# Altium project MultiChannelLdc_Project.PrjPcb
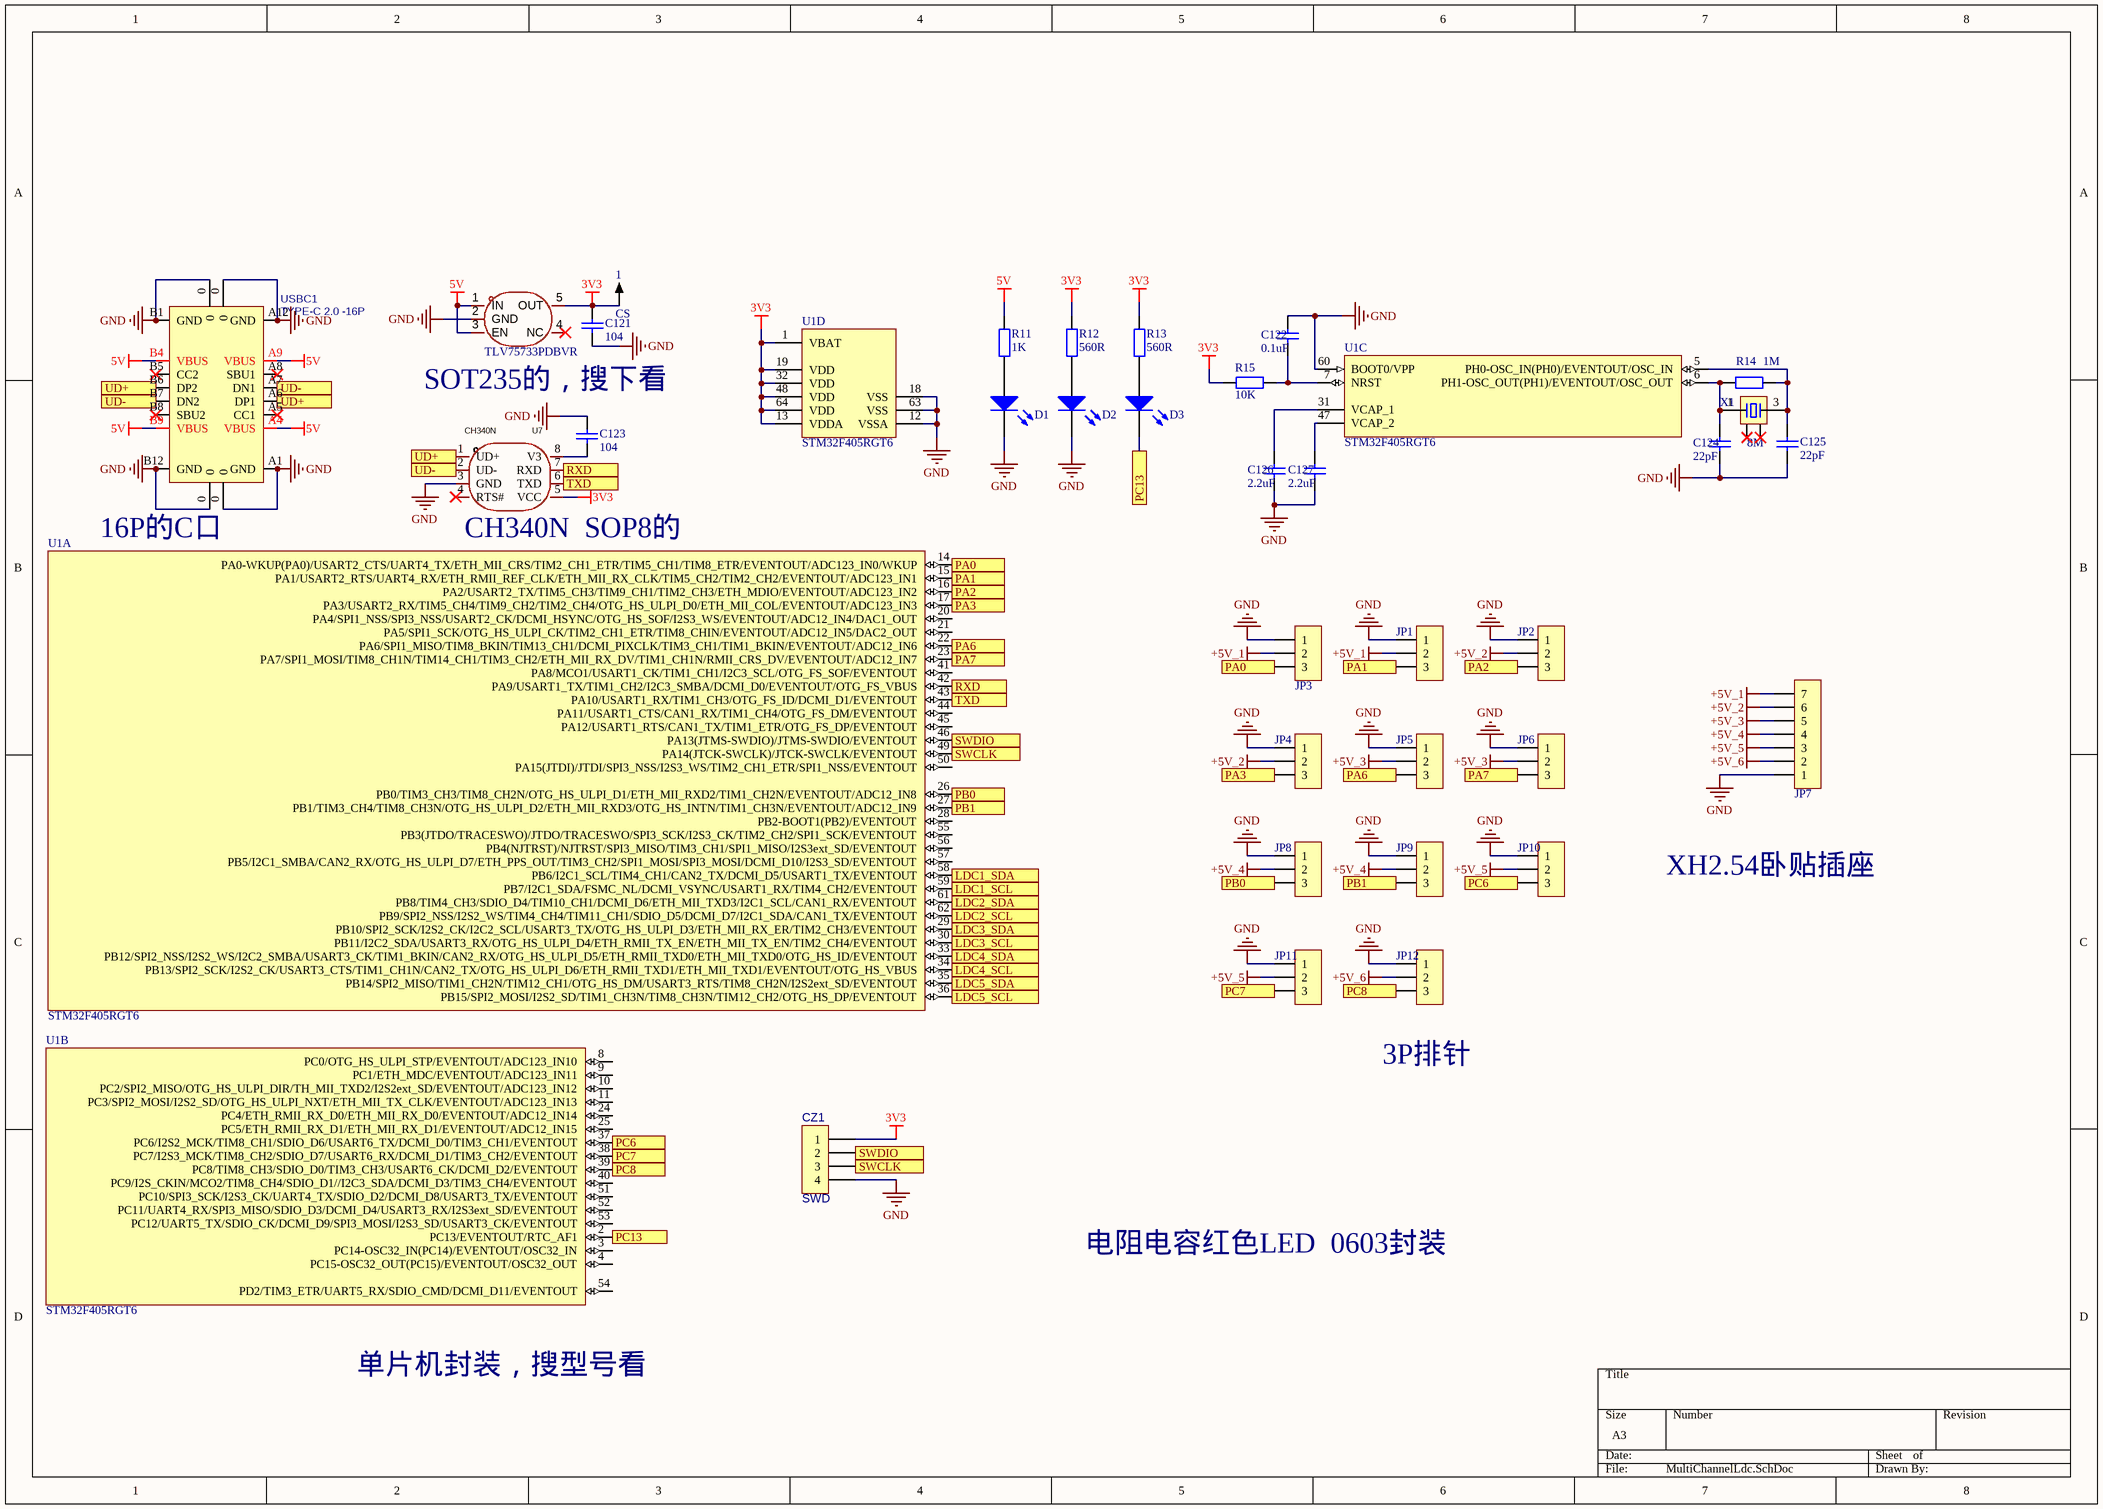
[diagram p0: MultiChannelLdc.SchDoc]
4 sheets, 194 parts. Net scope: flat (ports and power ports of the same name join across sheets).
Board file: MultiChannelLdc.PcbDoc
Sheets:
  MultiChannelLdc.SchDoc
  MultiChannelLdc2.SchDoc
  MultiChannelLdc3.SchDoc
  MultiChannelLdc4.SchDoc

## Sheet MultiChannelLdc.SchDoc
size A3

### Parts
1  CS  [TEST 1.2]
C121  104  [C0603_L]
C122  0.1uF  [C0603_L]
C123  104  [C0603_L]
C124  22pF  [C0603_L]
C125  22pF  [C0603_L]
C126  2.2uF  [C0603_L]
C127  2.2uF  [C0603_L]
CZ1  SWD  [SIP4]
D1  LED  [LED0603_R]  (value not drawn)
D2  LED  [LED0603_R]  (value not drawn)
D3  LED  [LED0603_R]  (value not drawn)
JP1  HDR-1X3  [HDR2.54-LI-3P]  (value not drawn)
JP2  HDR-1X3  [HDR2.54-LI-3P]  (value not drawn)
JP3  HDR-1X3  [HDR2.54-LI-3P]  (value not drawn)
JP4  HDR-1X3  [HDR2.54-LI-3P]  (value not drawn)
JP5  HDR-1X3  [HDR2.54-LI-3P]  (value not drawn)
JP6  HDR-1X3  [HDR2.54-LI-3P]  (value not drawn)
JP7  HDR-1X7  [XH2.54-LS-7P]  (value not drawn)
JP8  HDR-1X3  [HDR2.54-LI-3P]  (value not drawn)
JP9  HDR-1X3  [HDR2.54-LI-3P]  (value not drawn)
JP10  HDR-1X3  [HDR2.54-LI-3P]  (value not drawn)
JP11  HDR-1X3  [HDR2.54-LI-3P]  (value not drawn)
JP12  HDR-1X3  [HDR2.54-LI-3P]  (value not drawn)
R11  1K  [R0603_L]
R12  560R  [R0603_L]
R13  560R  [R0603_L]
R14  1M  [R0603_L]
R15  10K  [R0603_L]
U1  STM32F405RGT6  [TQFP64_V]  (parts A,B,C,D of 4)
U6  TLV75733PDBVR  [SOT23-5]
U7  CH340N  [SOP8_N]
USBC1  TYPE-C 2.0 -16P  [USB-C-SMD_16P]
X1  8M  [SMD3225]

### Ports
LDC1_SCL, LDC1_SDA, LDC2_SCL, LDC2_SDA, LDC3_SCL, LDC3_SDA, LDC4_SCL, LDC4_SDA, LDC5_SCL, LDC5_SDA, PA0, PA1, PA2, PA3, PA6, PA7, PB0, PB1, PC6, PC7, PC8, PC13, RXD, SWCLK, SWDIO, TXD, UD+, UD-

### Nets
3V3: 1.1 C121.2 CZ1.1 R12.2 R13.2 R15.1 U1.1(VBAT) U1.13(VDDA) U1.19(VDD) U1.32(VDD) U1.48(VDD) U1.64(VDD) U6.5(OUT) U7.5(VCC)
5V: R11.2 U6.1(IN) U6.3(EN) USBC1.A4(VBUS) USBC1.A9(VBUS) USBC1.B4(VBUS) USBC1.B9(VBUS)
+5V_1: JP1.2 JP3.2 JP7.7
+5V_2: JP2.2 JP4.2 JP7.6
+5V_3: JP5.2 JP6.2 JP7.5
+5V_4: JP7.4 JP8.2 JP9.2
+5V_5: JP7.3 JP10.2 JP11.2
+5V_6: JP7.2 JP12.2
GND: C121.1 C122.2 C123.2 C124.1 C125.1 C126.1 C127.1 CZ1.4 D1.2(K) D2.2(K) JP1.1 JP2.1 JP3.1 JP4.1 JP5.1 JP6.1 JP7.1 JP8.1 JP9.1 JP10.1 JP11.1 JP12.1 U1.12(VSSA) U1.18(VSS) U1.60(BOOT0/VPP) U1.63(VSS) U6.2(GND) U7.3(GND) USBC1.0 USBC1.A1(GND) USBC1.A12(GND) USBC1.B1(GND) USBC1.B12(GND)
NetC122_1: C122.1 R15.2 U1.7(NRST)
NetC123_1: C123.1 U7.8(V3)
NetC124_2: C124.2 R14.2 U1.6(PH1-OSC_OUT(PH1)/EVENTOUT/OSC_OUT) X1.1
NetC125_2: C125.2 R14.1 U1.5(PH0-OSC_IN(PH0)/EVENTOUT/OSC_IN) X1.3
NetC126_2: C126.2 U1.31(VCAP_1)
NetC127_2: C127.2 U1.47(VCAP_2)
NetCZ1_2: CZ1.2 U1.46(PA13(JTMS-SWDIO)/JTMS-SWDIO/EVENTOUT) ; port SWDIO
NetCZ1_3: CZ1.3 U1.49(PA14(JTCK-SWCLK)/JTCK-SWCLK/EVENTOUT) ; port SWCLK
NetD1_1: D1.1(A) R11.1
NetD2_1: D2.1(A) R12.1
NetD3_1: D3.1(A) R13.1
NetD3_2: D3.2(K) U1.2(PC13/EVENTOUT/RTC_AF1) ; port PC13
NetJP1_3: JP1.3 U1.15(PA1/USART2_RTS/UART4_RX/ETH_RMII_REF_CLK/ETH_MII_RX_CLK/TIM5_CH2/TIM2_CH2/EVENTOUT/ADC123_IN1) ; port PA1
NetJP2_3: JP2.3 U1.16(PA2/USART2_TX/TIM5_CH3/TIM9_CH1/TIM2_CH3/ETH_MDIO/EVENTOUT/ADC123_IN2) ; port PA2
NetJP3_3: JP3.3 U1.14(PA0-WKUP(PA0)/USART2_CTS/UART4_TX/ETH_MII_CRS/TIM2_CH1_ETR/TIM5_CH1/TIM8_ETR/EVENTOUT/ADC123_IN0/WKUP) ; port PA0
NetJP4_3: JP4.3 U1.17(PA3/USART2_RX/TIM5_CH4/TIM9_CH2/TIM2_CH4/OTG_HS_ULPI_D0/ETH_MII_COL/EVENTOUT/ADC123_IN3) ; port PA3
NetJP5_3: JP5.3 U1.22(PA6/SPI1_MISO/TIM8_BKIN/TIM13_CH1/DCMI_PIXCLK/TIM3_CH1/TIM1_BKIN/EVENTOUT/ADC12_IN6) ; port PA6
NetJP6_3: JP6.3 U1.23(PA7/SPI1_MOSI/TIM8_CH1N/TIM14_CH1/TIM3_CH2/ETH_MII_RX_DV/TIM1_CH1N/RMII_CRS_DV/EVENTOUT/ADC12_IN7) ; port PA7
NetJP8_3: JP8.3 U1.26(PB0/TIM3_CH3/TIM8_CH2N/OTG_HS_ULPI_D1/ETH_MII_RXD2/TIM1_CH2N/EVENTOUT/ADC12_IN8) ; port PB0
NetJP9_3: JP9.3 U1.27(PB1/TIM3_CH4/TIM8_CH3N/OTG_HS_ULPI_D2/ETH_MII_RXD3/OTG_HS_INTN/TIM1_CH3N/EVENTOUT/ADC12_IN9) ; port PB1
NetJP10_3: JP10.3 U1.37(PC6/I2S2_MCK/TIM8_CH1/SDIO_D6/USART6_TX/DCMI_D0/TIM3_CH1/EVENTOUT) ; port PC6
NetJP11_3: JP11.3 U1.38(PC7/I2S3_MCK/TIM8_CH2/SDIO_D7/USART6_RX/DCMI_D1/TIM3_CH2/EVENTOUT) ; port PC7
NetJP12_3: JP12.3 U1.39(PC8/TIM8_CH3/SDIO_D0/TIM3_CH3/USART6_CK/DCMI_D2/EVENTOUT) ; port PC8
NetR1_1: U1.58(PB6/I2C1_SCL/TIM4_CH1/CAN2_TX/DCMI_D5/USART1_TX/EVENTOUT) ; port LDC1_SDA
NetR3_1: U1.61(PB8/TIM4_CH3/SDIO_D4/TIM10_CH1/DCMI_D6/ETH_MII_TXD3/I2C1_SCL/CAN1_RX/EVENTOUT) ; port LDC2_SDA
NetR5_1: U1.29(PB10/SPI2_SCK/I2S2_CK/I2C2_SCL/USART3_TX/OTG_HS_ULPI_D3/ETH_MII_RX_ER/TIM2_CH3/EVENTOUT) ; port LDC3_SDA
NetR7_1: U1.33(PB12/SPI2_NSS/I2S2_WS/I2C2_SMBA/USART3_CK/TIM1_BKIN/CAN2_RX/OTG_HS_ULPI_D5/ETH_RMII_TXD0/ETH_MII_TXD0/OTG_HS_ID/EVENTOUT) ; port LDC4_SDA
NetR9_1: U1.35(PB14/SPI2_MISO/TIM1_CH2N/TIM12_CH1/OTG_HS_DM/USART3_RTS/TIM8_CH2N/I2S2ext_SD/EVENTOUT) ; port LDC5_SDA
NetU1_30: U1.30(PB11/I2C2_SDA/USART3_RX/OTG_HS_ULPI_D4/ETH_RMII_TX_EN/ETH_MII_TX_EN/TIM2_CH4/EVENTOUT) ; port LDC3_SCL
NetU1_34: U1.34(PB13/SPI2_SCK/I2S2_CK/USART3_CTS/TIM1_CH1N/CAN2_TX/OTG_HS_ULPI_D6/ETH_RMII_TXD1/ETH_MII_TXD1/EVENTOUT/OTG_HS_VBUS) ; port LDC4_SCL
NetU1_36: U1.36(PB15/SPI2_MOSI/I2S2_SD/TIM1_CH3N/TIM8_CH3N/TIM12_CH2/OTG_HS_DP/EVENTOUT) ; port LDC5_SCL
NetU1_42: U1.42(PA9/USART1_TX/TIM1_CH2/I2C3_SMBA/DCMI_D0/EVENTOUT/OTG_FS_VBUS) U7.7(RXD) ; port RXD
NetU1_43: U1.43(PA10/USART1_RX/TIM1_CH3/OTG_FS_ID/DCMI_D1/EVENTOUT) U7.6(TXD) ; port TXD
NetU1_59: U1.59(PB7/I2C1_SDA/FSMC_NL/DCMI_VSYNC/USART1_RX/TIM4_CH2/EVENTOUT) ; port LDC1_SCL
NetU1_62: U1.62(PB9/SPI2_NSS/I2S2_WS/TIM4_CH4/TIM11_CH1/SDIO_D5/DCMI_D7/I2C1_SDA/CAN1_TX/EVENTOUT) ; port LDC2_SCL
NetU7_1: U7.1(UD+) USBC1.A6(DP1) USBC1.B6(DP2) ; port UD+
NetU7_2: U7.2(UD-) USBC1.A7(DN1) USBC1.B7(DN2) ; port UD-

Not connected (* = marked no-connect by the designer): U1 3(PC14-OSC32_IN(PC14)/EVENTOUT/OSC32_IN) 4(PC15-OSC32_OUT(PC15)/EVENTOUT/OSC32_OUT) 8(PC0/OTG_HS_ULPI_STP/EVENTOUT/ADC123_IN10) 9(PC1/ETH_MDC/EVENTOUT/ADC123_IN11) 10(PC2/SPI2_MISO/OTG_HS_ULPI_DIR/TH_MII_TXD2/I2S2ext_SD/EVENTOUT/ADC123_IN12) 11(PC3/SPI2_MOSI/I2S2_SD/OTG_HS_ULPI_NXT/ETH_MII_TX_CLK/EVENTOUT/ADC123_IN13) 20(PA4/SPI1_NSS/SPI3_NSS/USART2_CK/DCMI_HSYNC/OTG_HS_SOF/I2S3_WS/EVENTOUT/ADC12_IN4/DAC1_OUT) 21(PA5/SPI1_SCK/OTG_HS_ULPI_CK/TIM2_CH1_ETR/TIM8_CHIN/EVENTOUT/ADC12_IN5/DAC2_OUT) 24(PC4/ETH_RMII_RX_D0/ETH_MII_RX_D0/EVENTOUT/ADC12_IN14) 25(PC5/ETH_RMII_RX_D1/ETH_MII_RX_D1/EVENTOUT/ADC12_IN15) 28(PB2-BOOT1(PB2)/EVENTOUT) 40(PC9/I2S_CKIN/MCO2/TIM8_CH4/SDIO_D1//I2C3_SDA/DCMI_D3/TIM3_CH4/EVENTOUT) 41(PA8/MCO1/USART1_CK/TIM1_CH1/I2C3_SCL/OTG_FS_SOF/EVENTOUT) 44(PA11/USART1_CTS/CAN1_RX/TIM1_CH4/OTG_FS_DM/EVENTOUT) 45(PA12/USART1_RTS/CAN1_TX/TIM1_ETR/OTG_FS_DP/EVENTOUT) 50(PA15(JTDI)/JTDI/SPI3_NSS/I2S3_WS/TIM2_CH1_ETR/SPI1_NSS/EVENTOUT) 51(PC10/SPI3_SCK/I2S3_CK/UART4_TX/SDIO_D2/DCMI_D8/USART3_TX/EVENTOUT) 52(PC11/UART4_RX/SPI3_MISO/SDIO_D3/DCMI_D4/USART3_RX/I2S3ext_SD/EVENTOUT) 53(PC12/UART5_TX/SDIO_CK/DCMI_D9/SPI3_MOSI/I2S3_SD/USART3_CK/EVENTOUT) 54(PD2/TIM3_ETR/UART5_RX/SDIO_CMD/DCMI_D11/EVENTOUT) 55(PB3(JTDO/TRACESWO)/JTDO/TRACESWO/SPI3_SCK/I2S3_CK/TIM2_CH2/SPI1_SCK/EVENTOUT) 56(PB4(NJTRST)/NJTRST/SPI3_MISO/TIM3_CH1/SPI1_MISO/I2S3ext_SD/EVENTOUT) 57(PB5/I2C1_SMBA/CAN2_RX/OTG_HS_ULPI_D7/ETH_PPS_OUT/TIM3_CH2/SPI1_MOSI/SPI3_MOSI/DCMI_D10/I2S3_SD/EVENTOUT); U6 4(NC)*; U7 4(RTS#)*; USBC1 A5(CC1)* A8(SBU1)* B5(CC2)* B8(SBU2)*; X1 2* 4*

### Notes on the sheet
- SOT235的，搜下看
- (near USBC1) 16P的C口
- (near U7) CH340N  SOP8的
- XH2.54卧贴插座
- (near JP12) 3P排针
- 电阻电容红色LED  0603封装
- 单片机封装，搜型号看

### Library data of the parts
1 = CS: 探针焊盘; 联系下单店铺卖家 免费技术支持: 联系下单店铺卖家 免费帮你查找封装; BOM名称: 探针焊盘
C121-C127 = C: 贴片电容/MLCC电容; BOM名称: 无极性贴片电容; 联系下单店铺卖家 免费帮你查找封装: 联系下单店铺卖家 免费技术支持
CZ1 = CON4: Connector
D1-D3 = LED0: 发光二极管; Published: 8-Jun-2000; LatestRevisionDate: 08-Jul-2005; LatestRevisionNote: Mech Layer 1 removed.; PackageReference: LED-0; Publisher: Altium Limited
JP1-JP6 JP8-JP12 = Header 3: 3P接插件; 联系卖家，免费查找封装: 唯一出售店铺网址https://shop463601444.taobao.com; 封装库来自淘宝卖家ID：黄晶宝石: 其他店铺购入均为盗版封装库，请立即申请退款，本店现金奖励50~200元; BOM名称: 3P接插件
JP7 = Header 7: 7P接插件; 联系卖家，免费查找封装: 唯一出售店铺网址https://shop463601444.taobao.com; 封装库来自淘宝卖家ID：黄晶宝石: 其他店铺购入均为盗版封装库，请立即申请退款，本店现金奖励50~200元; BOM名称: 7P接插件
R11-R15 = R: 贴片电阻; 联系下单店铺卖家 免费帮你查找封装: 联系下单店铺卖家 免费技术支持; BOM名称: 贴片电阻
U1 = STM32F405RGT6: ARM Cortex-M4 32b MCU+FPU, 210DMIP, 1024 kB Flash, 192+4 kB RAM, 51 I/Os, 64-pin LQFP, -40 to +85癈, Tray; Internal RAM: 192kB; Operating Frequency (Processor Speed): 168MHz; A/D Converter: 16x12-bit; D/A Converter: 2x12-bit; 16-bit Timers (IC/OC/PWM): 12x16-bit(24/24/30); 32-bit Timer (IC/OC/PWM): 2x32-bit (8/8/8); Other Timer Functions: 2xWDG, RTC, 24-bit down counter; Serial Interface: 3xSPI/2xI2S/2xI2C/3xUSART(IrDa, ISO7816)/3xUART/1xUSB OTG FS/HS, 2xCAN/ SDIO; 当前库版本V2023.3.12 @淘宝卖家:黄晶宝石: 最新版本发布https://item.taobao.com/item.htm?id=566775463719; DatasheetVersion: rev2, Jan-2012; PackageVersion: 2012; PackageReference: TQFP64; PackageDescription: 64-Pin Low Profile Quad Flat Package, 10x10 mm Body, 0.5 mm Pitch; ComponentLink1Description: Manufacturer URL; ComponentLink1URL: http://www.st.com/; ComponentLink2Description: STM32F405/7 Datasheet; ComponentLink2URL: http://www.st.com/internet/com/TECHNICAL_RESOURCES/TECHNICAL_LITERATURE/DATASHEET/DM00037051.pdf; ComponentLink3Description: STM32F4 Web Page; ComponentLink3URL: http://www.st.com/internet/mcu/subclass/1521.jsp
U7 = CH340N: Manufacturer: WCH(南京沁恒); Symbol: CH340N_C2977777; Add into BOM: yes; Applications Function: USB转串口; Protocol: USB 2.0; Number of Channels: 1; Voltage - Supply: 3.3V；5V; Data Rate: 2Mbps; Device: CH340N; LCSC Part Name: USB2.0芯片CH340; Supplier Part: C2977777; Manufacturer Part: CH340N; Supplier Footprint: SOP-8; JLCPCB Part Class: Extended Part; Datasheet: https://atta.szlcsc.com/upload/public/pdf/source/20240313/115CDE92081B1D6CB446704AD5D0F5F2.pdf; Supplier: LCSC; Convert to PCB: yes; Operating Temperature: -20℃~+70℃
USBC1 = USB2.0_Type-C_16Pin: USB2.0_Type-C_16Pin母座; 联系下单店铺卖家 免费技术支持: 联系下单店铺卖家 免费帮你查找封装
X1 = XTAL-4P: 4脚无源晶振(谐振器）; 联系下单店铺卖家 免费帮你查找封装: 联系下单店铺卖家 免费技术支持; BOM名称: 4脚无源晶振(谐振器）
U6 = TLV75733PDBVR: Symbol: TLV75733PDBVR

## Sheet MultiChannelLdc2.SchDoc
size A4
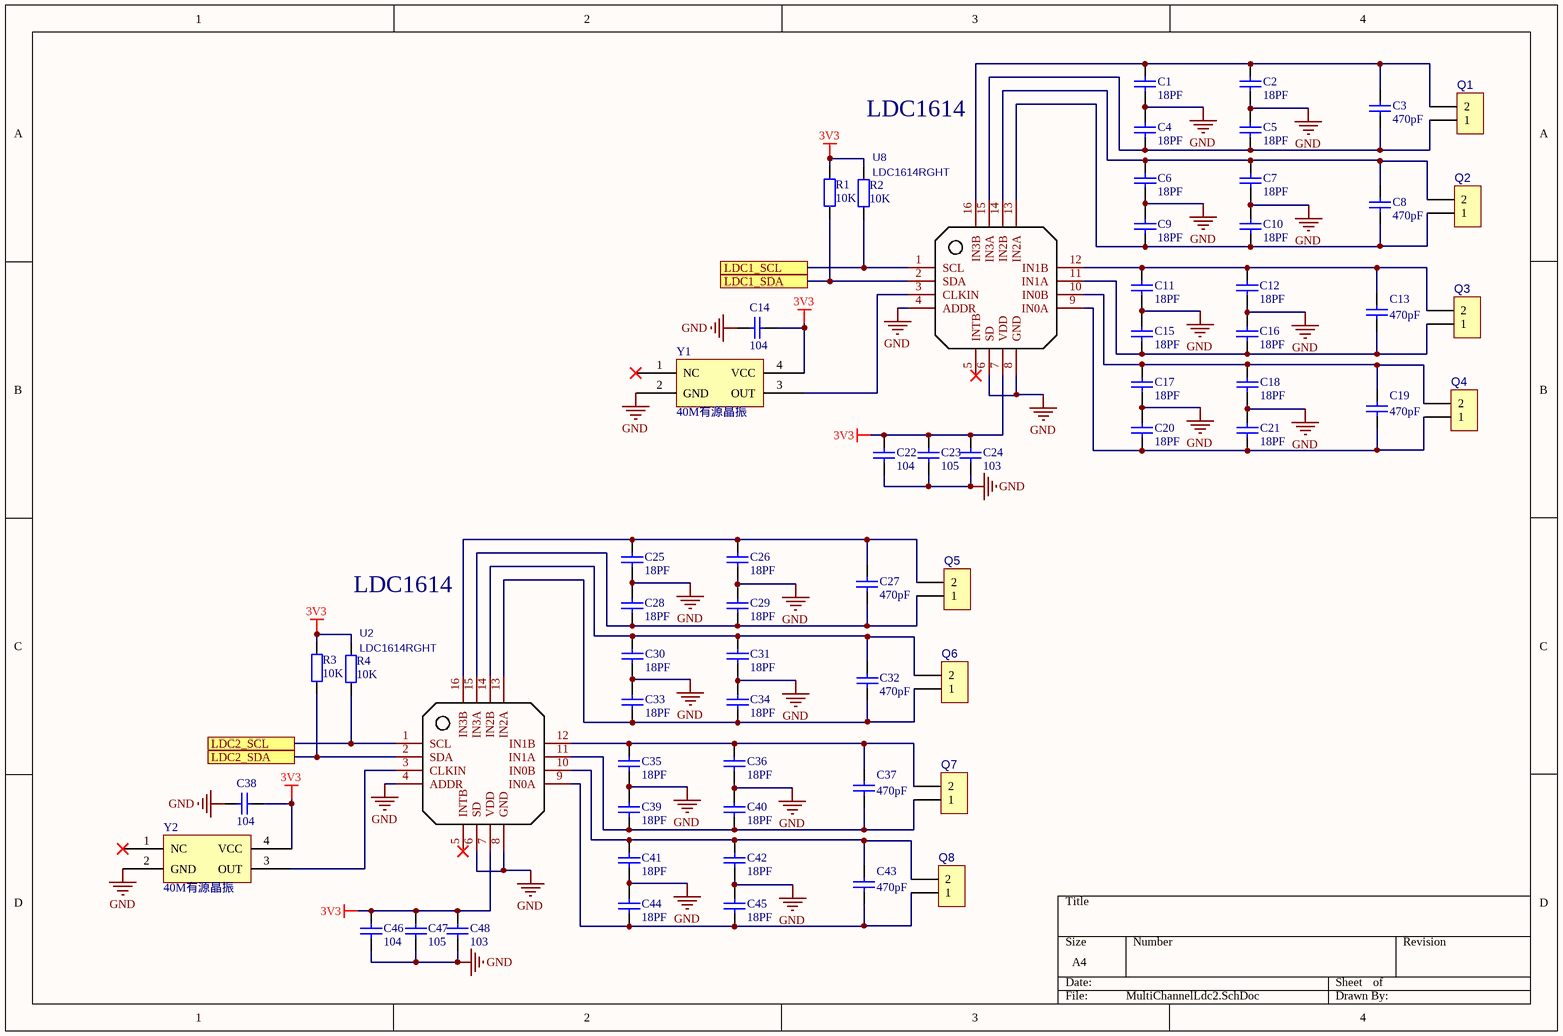
[diagram p1: MultiChannelLdc2.SchDoc]

### Parts
C1  18PF  [C0603_L]
C2  18PF  [C0603_L]
C3  470pF  [C0603_L]
C4  18PF  [C0603_L]
C5  18PF  [C0603_L]
C6  18PF  [C0603_L]
C7  18PF  [C0603_L]
C8  470pF  [C0603_L]
C9  18PF  [C0603_L]
C10  18PF  [C0603_L]
C11  18PF  [C0603_L]
C12  18PF  [C0603_L]
C13  470pF  [C0603_L]
C14  104  [C0603_L]
C15  18PF  [C0603_L]
C16  18PF  [C0603_L]
C17  18PF  [C0603_L]
C18  18PF  [C0603_L]
C19  470pF  [C0603_L]
C20  18PF  [C0603_L]
C21  18PF  [C0603_L]
C22  104  [C0603_L]
C23  105  [C0603_L]
C24  103  [C0603_L]
C25  18PF  [C0603_L]
C26  18PF  [C0603_L]
C27  470pF  [C0603_L]
C28  18PF  [C0603_L]
C29  18PF  [C0603_L]
C30  18PF  [C0603_L]
C31  18PF  [C0603_L]
C32  470pF  [C0603_L]
C33  18PF  [C0603_L]
C34  18PF  [C0603_L]
C35  18PF  [C0603_L]
C36  18PF  [C0603_L]
C37  470pF  [C0603_L]
C38  104  [C0603_L]
C39  18PF  [C0603_L]
C40  18PF  [C0603_L]
C41  18PF  [C0603_L]
C42  18PF  [C0603_L]
C43  470pF  [C0603_L]
C44  18PF  [C0603_L]
C45  18PF  [C0603_L]
C46  104  [C0603_L]
C47  105  [C0603_L]
C48  103  [C0603_L]
Q1  (no value)  [座子]
Q2  (no value)  [座子]
Q3  (no value)  [座子]
Q4  (no value)  [座子]
Q5  (no value)  [座子]
Q6  (no value)  [座子]
Q7  (no value)  [座子]
Q8  (no value)  [座子]
R1  value 10K  [R0603_L]  (hidden comment: Res2)
R2  value 10K  [R0603_L]  (hidden comment: Res2)
R3  value 10K  [R0603_L]  (hidden comment: Res2)
R4  value 10K  [R0603_L]  (hidden comment: Res2)
U2  LDC1614RGHT  [W-QFN-16]
U8  LDC1614RGHT  [W-QFN-16]
Y1  40M有源晶振  [SMD3225]
Y2  40M有源晶振  [SMD3225]

### Ports
LDC1_SCL, LDC1_SDA, LDC2_SCL, LDC2_SDA

### Nets
3V3: C14.1 C22.1 C23.1 C24.1 C38.1 C46.1 C47.1 C48.1 R1.2 R2.1 R3.2 R4.1 U2.7(VDD) U8.7(VDD) Y1.4(VCC) Y2.4(VCC)
GND: C1.2 C2.2 C4.1 C5.1 C6.2 C7.2 C9.1 C10.1 C11.2 C12.2 C14.2 C15.1 C16.1 C17.2 C18.2 C20.1 C21.1 C22.2 C23.2 C24.2 C25.2 C26.2 C28.1 C29.1 C30.2 C31.2 C33.1 C34.1 C35.2 C36.2 C38.2 C39.1 C40.1 C41.2 C42.2 C44.1 C45.1 C46.2 C47.2 C48.2 U2.4(ADDR) U2.6(SD) U2.8(GND) U8.4(ADDR) U8.6(SD) U8.8(GND) Y1.2(GND) Y2.2(GND)
NetC1_1: C1.1 C2.1 C3.2 Q1.2 U8.16(IN3B)
NetC3_1: C3.1 C4.2 C5.2 Q1.1 U8.15(IN3A)
NetC6_1: C6.1 C7.1 C8.2 Q2.2 U8.14(IN2B)
NetC8_1: C8.1 C9.2 C10.2 Q2.1 U8.13(IN2A)
NetC11_1: C11.1 C12.1 C13.2 Q3.2 U8.12(IN1B)
NetC13_1: C13.1 C15.2 C16.2 Q3.1 U8.11(IN1A)
NetC17_1: C17.1 C18.1 C19.2 Q4.2 U8.10(IN0B)
NetC19_1: C19.1 C20.2 C21.2 Q4.1 U8.9(IN0A)
NetC25_1: C25.1 C26.1 C27.2 Q5.2 U2.16(IN3B)
NetC27_1: C27.1 C28.2 C29.2 Q5.1 U2.15(IN3A)
NetC30_1: C30.1 C31.1 C32.2 Q6.2 U2.14(IN2B)
NetC32_1: C32.1 C33.2 C34.2 Q6.1 U2.13(IN2A)
NetC35_1: C35.1 C36.1 C37.2 Q7.2 U2.12(IN1B)
NetC37_1: C37.1 C39.2 C40.2 Q7.1 U2.11(IN1A)
NetC41_1: C41.1 C42.1 C43.2 Q8.2 U2.10(IN0B)
NetC43_1: C43.1 C44.2 C45.2 Q8.1 U2.9(IN0A)
NetR1_1: R1.1 U8.2(SDA) ; port LDC1_SDA
NetR3_1: R3.1 U2.2(SDA) ; port LDC2_SDA
NetU1_59: U8.1(SCL) ; port LDC1_SCL
NetU1_62: U2.1(SCL) ; port LDC2_SCL
NetU2_3: U2.3(CLKIN) Y2.3(OUT)
NetU8_3: U8.3(CLKIN) Y1.3(OUT)

Not connected (* = marked no-connect by the designer): R2 2; R4 2; U2 5(INTB)*; U8 5(INTB)*; Y1 1(NC)*; Y2 1(NC)*

### Notes on the sheet
- LDC1614

### Library data of the parts
C1-C13 C15-C21 C23-C37 C39-C45 C47 C48 = Cap: Capacitor; Value: 104; Published: 8-Jun-2000; LatestRevisionDate: 17-Jul-2002; LatestRevisionNote: Re-released for DXP Platform.; Publisher: Altium Limited
C14 C38 = C: as C121 on sheet MultiChannelLdc
C22 C46 = Cap: Capacitor; Published: 8-Jun-2000; LatestRevisionDate: 17-Jul-2002; LatestRevisionNote: Re-released for DXP Platform.; Publisher: Altium Limited; Value: 104
Q1-Q8 = CON2: Connector
R1-R4 = Res2: Resistor; Published: 8-Jun-2000; LatestRevisionDate: 17-Jul-2002; LatestRevisionNote: Re-released for DXP Platform.; PackageReference: AXIAL-0.4; Publisher: Altium Limited; PackageDescription: Axial Device, Thru-Hole; 2 Leads; 0.4 in Pin Spacing
U2 U8 = LDC1614RGHT: BOM_Manufacturer: TI; BOM_Manufacturer Part: LDC1314RGHT; SMT Type: Extend; BOM_Supplier: LCSC; image: //image.lceda.cn/szlcsc/C80399.jpg; BOM_Supplier Part: C80399; BOM_LCSC Assembly: Yes; spicePre: U; spiceSymbolName: LDC1314RGHT
Y1 Y2 = 有源晶振

## Sheet MultiChannelLdc3.SchDoc
size A4
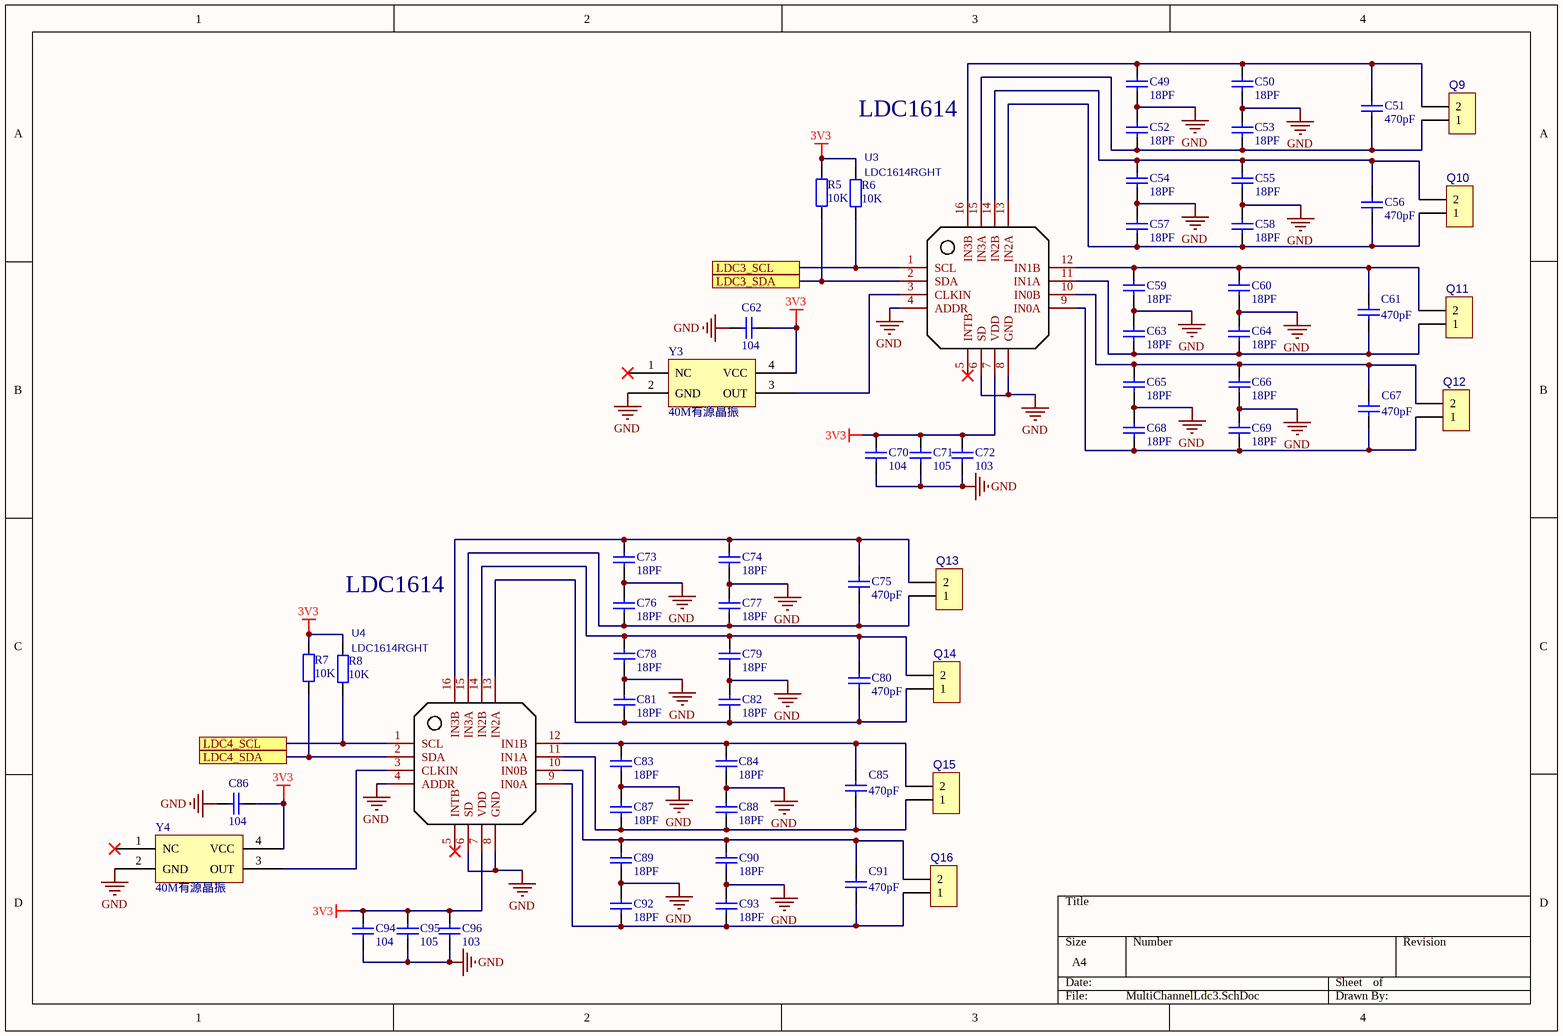
[diagram p2: MultiChannelLdc3.SchDoc]

### Parts
C49  18PF  [C0603_L]
C50  18PF  [C0603_L]
C51  470pF  [C0603_L]
C52  18PF  [C0603_L]
C53  18PF  [C0603_L]
C54  18PF  [C0603_L]
C55  18PF  [C0603_L]
C56  470pF  [C0603_L]
C57  18PF  [C0603_L]
C58  18PF  [C0603_L]
C59  18PF  [C0603_L]
C60  18PF  [C0603_L]
C61  470pF  [C0603_L]
C62  104  [C0603_L]
C63  18PF  [C0603_L]
C64  18PF  [C0603_L]
C65  18PF  [C0603_L]
C66  18PF  [C0603_L]
C67  470pF  [C0603_L]
C68  18PF  [C0603_L]
C69  18PF  [C0603_L]
C70  104  [C0603_L]
C71  105  [C0603_L]
C72  103  [C0603_L]
C73  18PF  [C0603_L]
C74  18PF  [C0603_L]
C75  470pF  [C0603_L]
C76  18PF  [C0603_L]
C77  18PF  [C0603_L]
C78  18PF  [C0603_L]
C79  18PF  [C0603_L]
C80  470pF  [C0603_L]
C81  18PF  [C0603_L]
C82  18PF  [C0603_L]
C83  18PF  [C0603_L]
C84  18PF  [C0603_L]
C85  470pF  [C0603_L]
C86  104  [C0603_L]
C87  18PF  [C0603_L]
C88  18PF  [C0603_L]
C89  18PF  [C0603_L]
C90  18PF  [C0603_L]
C91  470pF  [C0603_L]
C92  18PF  [C0603_L]
C93  18PF  [C0603_L]
C94  104  [C0603_L]
C95  105  [C0603_L]
C96  103  [C0603_L]
Q9  (no value)  [座子]
Q10  (no value)  [座子]
Q11  (no value)  [座子]
Q12  (no value)  [座子]
Q13  (no value)  [座子]
Q14  (no value)  [座子]
Q15  (no value)  [座子]
Q16  (no value)  [座子]
R5  value 10K  [R0603_L]  (hidden comment: Res2)
R6  value 10K  [R0603_L]  (hidden comment: Res2)
R7  value 10K  [R0603_L]  (hidden comment: Res2)
R8  value 10K  [R0603_L]  (hidden comment: Res2)
U3  LDC1614RGHT  [W-QFN-16]
U4  LDC1614RGHT  [W-QFN-16]
Y3  40M有源晶振  [SMD3225]
Y4  40M有源晶振  [SMD3225]

### Ports
LDC3_SCL, LDC3_SDA, LDC4_SCL, LDC4_SDA

### Nets
3V3: C62.1 C70.1 C71.1 C72.1 C86.1 C94.1 C95.1 C96.1 R5.2 R6.1 R7.2 R8.1 U3.7(VDD) U4.7(VDD) Y3.4(VCC) Y4.4(VCC)
GND: C49.2 C50.2 C52.1 C53.1 C54.2 C55.2 C57.1 C58.1 C59.2 C60.2 C62.2 C63.1 C64.1 C65.2 C66.2 C68.1 C69.1 C70.2 C71.2 C72.2 C73.2 C74.2 C76.1 C77.1 C78.2 C79.2 C81.1 C82.1 C83.2 C84.2 C86.2 C87.1 C88.1 C89.2 C90.2 C92.1 C93.1 C94.2 C95.2 C96.2 U3.4(ADDR) U3.6(SD) U3.8(GND) U4.4(ADDR) U4.6(SD) U4.8(GND) Y3.2(GND) Y4.2(GND)
NetC49_1: C49.1 C50.1 C51.2 Q9.2 U3.16(IN3B)
NetC51_1: C51.1 C52.2 C53.2 Q9.1 U3.15(IN3A)
NetC54_1: C54.1 C55.1 C56.2 Q10.2 U3.14(IN2B)
NetC56_1: C56.1 C57.2 C58.2 Q10.1 U3.13(IN2A)
NetC59_1: C59.1 C60.1 C61.2 Q11.2 U3.12(IN1B)
NetC61_1: C61.1 C63.2 C64.2 Q11.1 U3.11(IN1A)
NetC65_1: C65.1 C66.1 C67.2 Q12.2 U3.10(IN0B)
NetC67_1: C67.1 C68.2 C69.2 Q12.1 U3.9(IN0A)
NetC73_1: C73.1 C74.1 C75.2 Q13.2 U4.16(IN3B)
NetC75_1: C75.1 C76.2 C77.2 Q13.1 U4.15(IN3A)
NetC78_1: C78.1 C79.1 C80.2 Q14.2 U4.14(IN2B)
NetC80_1: C80.1 C81.2 C82.2 Q14.1 U4.13(IN2A)
NetC83_1: C83.1 C84.1 C85.2 Q15.2 U4.12(IN1B)
NetC85_1: C85.1 C87.2 C88.2 Q15.1 U4.11(IN1A)
NetC89_1: C89.1 C90.1 C91.2 Q16.2 U4.10(IN0B)
NetC91_1: C91.1 C92.2 C93.2 Q16.1 U4.9(IN0A)
NetR5_1: R5.1 U3.2(SDA) ; port LDC3_SDA
NetR7_1: R7.1 U4.2(SDA) ; port LDC4_SDA
NetU1_30: U3.1(SCL) ; port LDC3_SCL
NetU1_34: U4.1(SCL) ; port LDC4_SCL
NetU3_3: U3.3(CLKIN) Y3.3(OUT)
NetU4_3: U4.3(CLKIN) Y4.3(OUT)

Not connected (* = marked no-connect by the designer): R6 2; R8 2; U3 5(INTB)*; U4 5(INTB)*; Y3 1(NC)*; Y4 1(NC)*

### Notes on the sheet
- LDC1614

### Library data of the parts
C49-C61 C63-C69 C71-C85 C87-C93 C95 C96 = Cap: Capacitor; Value: 104; Published: 8-Jun-2000; LatestRevisionDate: 17-Jul-2002; LatestRevisionNote: Re-released for DXP Platform.; Publisher: Altium Limited
C62 C86 = C: as C121 on sheet MultiChannelLdc
C70 C94 = Cap: Capacitor; Published: 8-Jun-2000; LatestRevisionDate: 17-Jul-2002; LatestRevisionNote: Re-released for DXP Platform.; Publisher: Altium Limited; Value: 104
Q9-Q16 = CON2: Connector
R5-R8 = Res2: Resistor; Published: 8-Jun-2000; LatestRevisionDate: 17-Jul-2002; LatestRevisionNote: Re-released for DXP Platform.; PackageReference: AXIAL-0.4; Publisher: Altium Limited; PackageDescription: Axial Device, Thru-Hole; 2 Leads; 0.4 in Pin Spacing
U3 U4 = LDC1614RGHT: as U2 on sheet MultiChannelLdc2; BOM_Supplier: LCSC; image: //image.lceda.cn/szlcsc/C80399.jpg; BOM_Supplier Part: C80399; BOM_LCSC Assembly: Yes; spicePre: U; spiceSymbolName: LDC1314RGHT
Y3 Y4 = 有源晶振

## Sheet MultiChannelLdc4.SchDoc
size A4
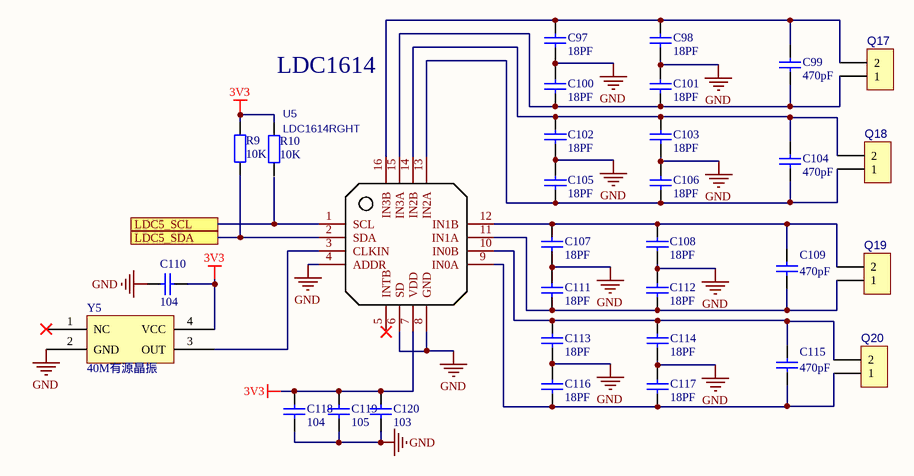
[diagram p3: MultiChannelLdc4.SchDoc]

### Parts
C97  18PF  [C0603_L]
C98  18PF  [C0603_L]
C99  470pF  [C0603_L]
C100  18PF  [C0603_L]
C101  18PF  [C0603_L]
C102  18PF  [C0603_L]
C103  18PF  [C0603_L]
C104  470pF  [C0603_L]
C105  18PF  [C0603_L]
C106  18PF  [C0603_L]
C107  18PF  [C0603_L]
C108  18PF  [C0603_L]
C109  470pF  [C0603_L]
C110  104  [C0603_L]
C111  18PF  [C0603_L]
C112  18PF  [C0603_L]
C113  18PF  [C0603_L]
C114  18PF  [C0603_L]
C115  470pF  [C0603_L]
C116  18PF  [C0603_L]
C117  18PF  [C0603_L]
C118  104  [C0603_L]
C119  105  [C0603_L]
C120  103  [C0603_L]
Q17  (no value)  [座子]
Q18  (no value)  [座子]
Q19  (no value)  [座子]
Q20  (no value)  [座子]
R9  value 10K  [R0603_L]  (hidden comment: Res2)
R10  value 10K  [R0603_L]  (hidden comment: Res2)
U5  LDC1614RGHT  [W-QFN-16]
Y5  40M有源晶振  [SMD3225]

### Ports
LDC5_SCL, LDC5_SDA

### Nets
3V3: C110.1 C118.1 C119.1 C120.1 R9.2 R10.1 U5.7(VDD) Y5.4(VCC)
GND: C97.2 C98.2 C100.1 C101.1 C102.2 C103.2 C105.1 C106.1 C107.2 C108.2 C110.2 C111.1 C112.1 C113.2 C114.2 C116.1 C117.1 C118.2 C119.2 C120.2 U5.4(ADDR) U5.6(SD) U5.8(GND) Y5.2(GND)
NetC97_1: C97.1 C98.1 C99.2 Q17.2 U5.16(IN3B)
NetC99_1: C99.1 C100.2 C101.2 Q17.1 U5.15(IN3A)
NetC102_1: C102.1 C103.1 C104.2 Q18.2 U5.14(IN2B)
NetC104_1: C104.1 C105.2 C106.2 Q18.1 U5.13(IN2A)
NetC107_1: C107.1 C108.1 C109.2 Q19.2 U5.12(IN1B)
NetC109_1: C109.1 C111.2 C112.2 Q19.1 U5.11(IN1A)
NetC113_1: C113.1 C114.1 C115.2 Q20.2 U5.10(IN0B)
NetC115_1: C115.1 C116.2 C117.2 Q20.1 U5.9(IN0A)
NetR9_1: R9.1 U5.2(SDA) ; port LDC5_SDA
NetU1_36: U5.1(SCL) ; port LDC5_SCL
NetU5_3: U5.3(CLKIN) Y5.3(OUT)

Not connected (* = marked no-connect by the designer): R10 2; U5 5(INTB)*; Y5 1(NC)*

### Notes on the sheet
- LDC1614

### Library data of the parts
C97-C109 C111-C117 C119 C120 = Cap: Capacitor; Value: 104; Published: 8-Jun-2000; LatestRevisionDate: 17-Jul-2002; LatestRevisionNote: Re-released for DXP Platform.; Publisher: Altium Limited
C110 = C: as C121 on sheet MultiChannelLdc
C118 = Cap: Capacitor; Published: 8-Jun-2000; LatestRevisionDate: 17-Jul-2002; LatestRevisionNote: Re-released for DXP Platform.; Publisher: Altium Limited; Value: 104
Q17-Q20 = CON2: Connector
R9 R10 = Res2: Resistor; Published: 8-Jun-2000; LatestRevisionDate: 17-Jul-2002; LatestRevisionNote: Re-released for DXP Platform.; PackageReference: AXIAL-0.4; Publisher: Altium Limited; PackageDescription: Axial Device, Thru-Hole; 2 Leads; 0.4 in Pin Spacing
U5 = LDC1614RGHT: as U2 on sheet MultiChannelLdc2; BOM_Supplier: LCSC; image: //image.lceda.cn/szlcsc/C80399.jpg; BOM_Supplier Part: C80399; BOM_LCSC Assembly: Yes; spicePre: U; spiceSymbolName: LDC1314RGHT
Y5 = 有源晶振

## Nets that join several sheets
3V3: MultiChannelLdc (14 pins), MultiChannelLdc2 (16 pins), MultiChannelLdc3 (16 pins), MultiChannelLdc4 (8 pins)
GND: MultiChannelLdc (33 pins), MultiChannelLdc2 (48 pins), MultiChannelLdc3 (48 pins), MultiChannelLdc4 (24 pins)
NetR1_1: MultiChannelLdc (U1.58), MultiChannelLdc2 (R1.1 U8.2)
NetR3_1: MultiChannelLdc (U1.61), MultiChannelLdc2 (R3.1 U2.2)
NetR5_1: MultiChannelLdc (U1.29), MultiChannelLdc3 (R5.1 U3.2)
NetR7_1: MultiChannelLdc (U1.33), MultiChannelLdc3 (R7.1 U4.2)
NetR9_1: MultiChannelLdc (U1.35), MultiChannelLdc4 (R9.1 U5.2)
NetU1_30: MultiChannelLdc (U1.30), MultiChannelLdc3 (U3.1)
NetU1_34: MultiChannelLdc (U1.34), MultiChannelLdc3 (U4.1)
NetU1_36: MultiChannelLdc (U1.36), MultiChannelLdc4 (U5.1)
NetU1_59: MultiChannelLdc (U1.59), MultiChannelLdc2 (U8.1)
NetU1_62: MultiChannelLdc (U1.62), MultiChannelLdc2 (U2.1)